# EasyEDA Pro project Air Purifier ESP32C6.eprj

# Schematic Schematic1
Board Name: Board1; Create Date: 2026-03-30; Page Name: P1; Project Name: Air Purifier ESP32C6; Schematic Name: Schematic1; Update Date: 2026-04-22; Company: EasyEDA.com; Page Size: A4; Version: V1.0
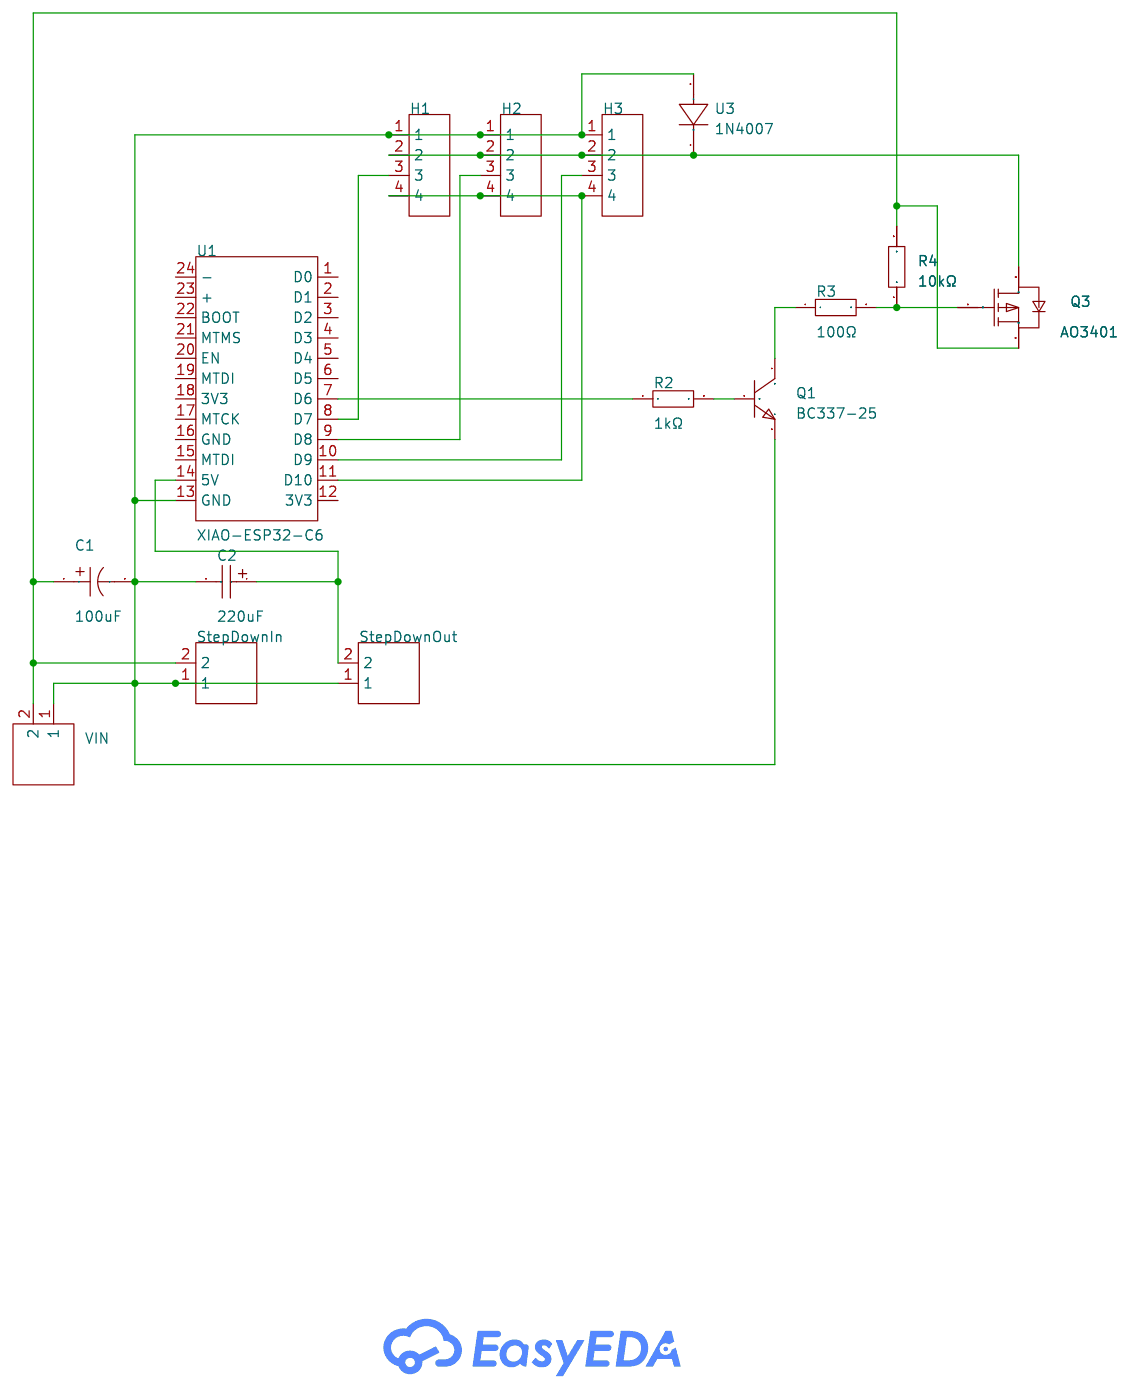
[diagram p0: schematic sheet]

## Parts
C1  100uF  [CAP-SMD_BD6.3-L6.6-W6.6-RD]
C2  220uF  [CASE-D_7343]
H1  -  [HDR-TH_4P-P2.54-V-M]
H2  -  [HDR-TH_4P-P2.54-V-M]
H3  -  [HDR-TH_4P-P2.54-V-M]
Q1  BC337-25  [TO-92-3_L4.9-W3.7-P1.27-L]
Q3  AO3401  [SOT-23-3_L2.9-W1.3-P1.90-LS2.4-BR]
R2  1kΩ  [R1206]
R3  100Ω  [R1206]
R4  10kΩ  [R1206]
StepDownIn  -  [HDR-TH_2P-P2.54-V-M-1]
StepDownOut  -  [HDR-TH_2P-P2.54-V-M-1]
U1  XIAO-ESP32-C6  [LCC-14P_L17.7-W20.8-XIAO-ESP32-C6]
U3  1N4007  [DO-41_BD2.4-L4.7-P8.70-D0.6-RD]
VIN  -  [HDR-TH_2P-P2.54-V-M-1]

## Library data of the parts
C1 = 8101LDMAA07MH0001T: LCSC Part Name: 100uF ±20% 25V; Supplier Part: C2932852; Manufacturer: FH(风华); Supplier Footprint: SMD,D6.3xL7.7mm; JLCPCB Part Class: Extended Part; Datasheet: https://item.szlcsc.com/datasheet/8101LDMAA07MH0001T/3278565.html; Supplier: LCSC; Tolerance: ±20%; Voltage Rating: 25V; Ripple Current: 91mA@120Hz; Diameter: 6.3mm; Height - Seated (Max): 7.7mm; Operating Temperature: -40℃~+105℃
C2 = TAJD227K010RNJ: LCSC Part Name: 220uF ±10% 10V; Supplier Part: C8024; Manufacturer: Kyocera AVX; Supplier Footprint: CASE-D-7343; JLCPCB Part Class: Extended Part; Datasheet: https://atta.szlcsc.com/upload/public/pdf/source/20160107/1457707750344.pdf; Supplier: LCSC; Tolerance: ±10%; Equivalent Series Resistance(ESR): 500mΩ@100kHz; Operating Temperature: -55℃~+125℃
H1-H3 = HDR-M_2.54_1x4P: Supplier Footprint: Through
Q1 = BC337-25_C713610: Supplier Part: C713610; Manufacturer: LGE(鲁光); Supplier Footprint: TO-92-3; JLCPCB Part Class: Extended Part; Datasheet: https://atta.szlcsc.com/upload/public/pdf/source/20200731/C713609_2BF9102A3EBD29C1F5C6CEBDB020064D.pdf; Supplier: LCSC; type: NPN; Current - Collector(Ic): 800mA; Pd - Power Dissipation: 625mW; DC Current Gain: 160@100mA,1V; Transition frequency(fT): 210MHz; Current - Collector Cutoff: 100nA; Vce Saturation(VCE(sat)): 700mV
Q3 = AO3401_C6575062: LCSC Part Name: 1个P沟道 耐压:30V 电流:4.1A; Supplier Part: C6575062; Manufacturer: YONGYUTAI(永裕泰); Supplier Footprint: SOT-23; JLCPCB Part Class: Extended Part; Datasheet: https://item.szlcsc.com/datasheet/AO3401/7529492.html; Supplier: LCSC; Number: 1 P-Channel; Drain to Source Voltage: 30V; Current - Continuous Drain(Id): 4.1A; RDS(on): 65mΩ@4.5V,4A; Pd - Power Dissipation: 1.25W; Gate Threshold Voltage (Vgs(th)): 1.3V; Input Capacitance(Ciss): 870pF@0V; Reverse Transfer Capacitance (Crss@Vds): 10pF; Operating Temperature: -55℃~+150℃; Output Capacitance(Coss): 74pF
R2-R4 = Res_1206: Supplier Footprint: 1206
StepDownIn StepDownOut VIN = HDR-M_2.54_1x2P: Supplier Footprint: Through
U1 = XIAO-ESP32-C6: Supplier Part: C9900124963; Supplier Footprint: LCC-14; JLCPCB Part Class: Extended Part; Supplier: LCSC
U3 = 1N4007_C5261026: LCSC Part Name: 1kV 1A; Supplier Part: C5261026; Manufacturer: CJ(江苏长电/长晶); Supplier Footprint: DO-41; JLCPCB Part Class: Extended Part; Datasheet: https://item.szlcsc.com/datasheet/1N4007/5983537.html; Supplier: LCSC; Voltage - Forward(Vf@If): 1.1V@1A; Voltage - DC Reverse(Vr): 1kV; Current - Rectified: 1A; Reverse Leakage Current (Ir): 5uA@1000V; Non-Repetitive Peak Forward Surge Current: 30A; Operating Junction Temperature Range: -55℃~+150℃

## Nets
GND: C1.2 C2.2 H1.1 H2.1 H3.1 Q1.3(E) StepDownIn.1 StepDownOut.1 U1.13(GND) U3.2(A) VIN.1
VCC: C1.1 Q3.2(S) R4.2 StepDownIn.2 VIN.2
ESPVCC: C2.1 StepDownOut.2 U1.14(5V)
FANVCC: H1.2 H2.2 H3.2 Q3.3(D) U3.1(C)
PWM: H1.4 H2.4 H3.4 U1.11(D10)
TACH1: H1.3 U1.8(D7)
TACH2: H2.3 U1.9(D8)
TACH3: H3.3 U1.10(D9)
$1N1294: R2.1 U1.7(D6)
$1N1298: Q1.2(B) R2.2
$1N2044: Q3.1(G) R3.2 R4.1
$1N2048: Q1.1(C) R3.1

Not connected (* = marked no-connect by the designer): U1 1(D0) 2(D1) 3(D2) 4(D3) 5(D4) 6(D5) 12(3V3) 15(MTDI) 16(GND) 17(MTCK) 18(3V3) 19(MTDI) 20(EN) 21(MTMS) 22(BOOT) 23(+) 24(-)

# Board PCB1
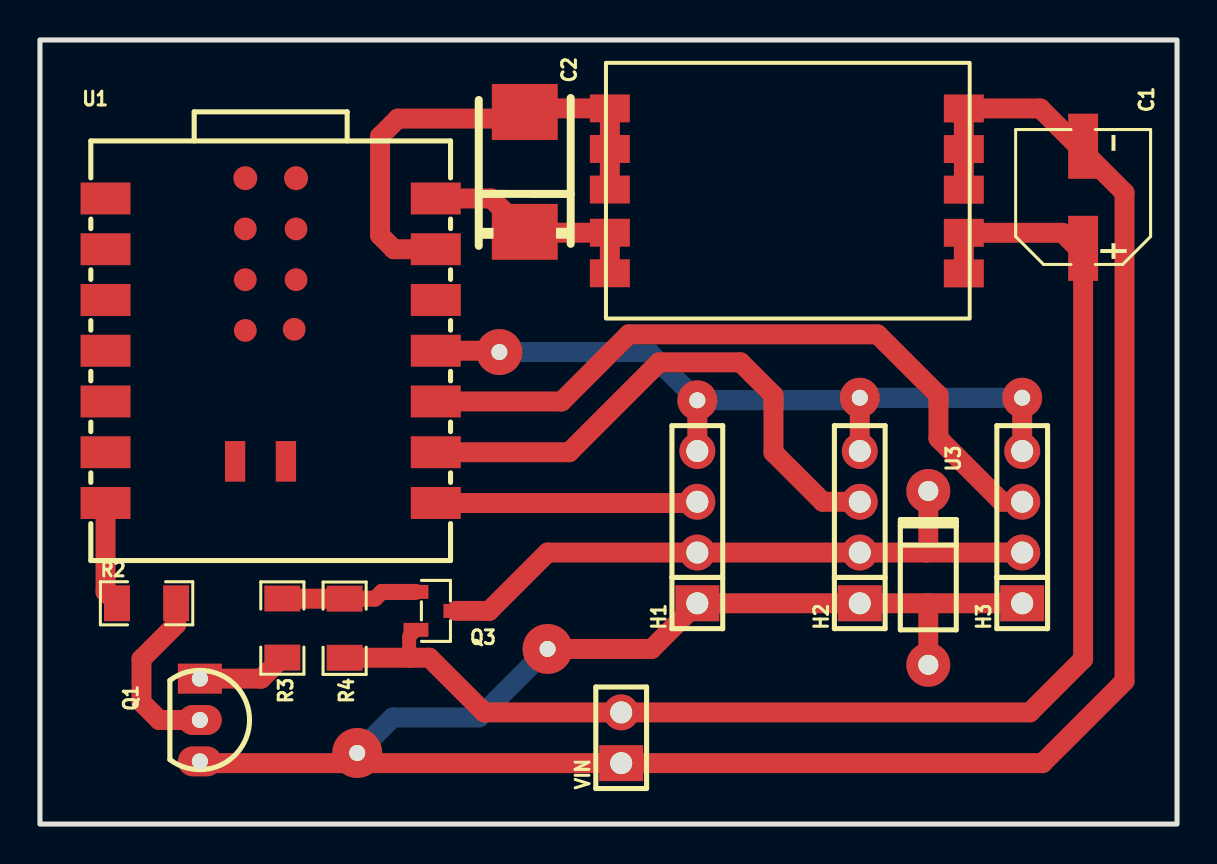
[diagram p1: board, top side]
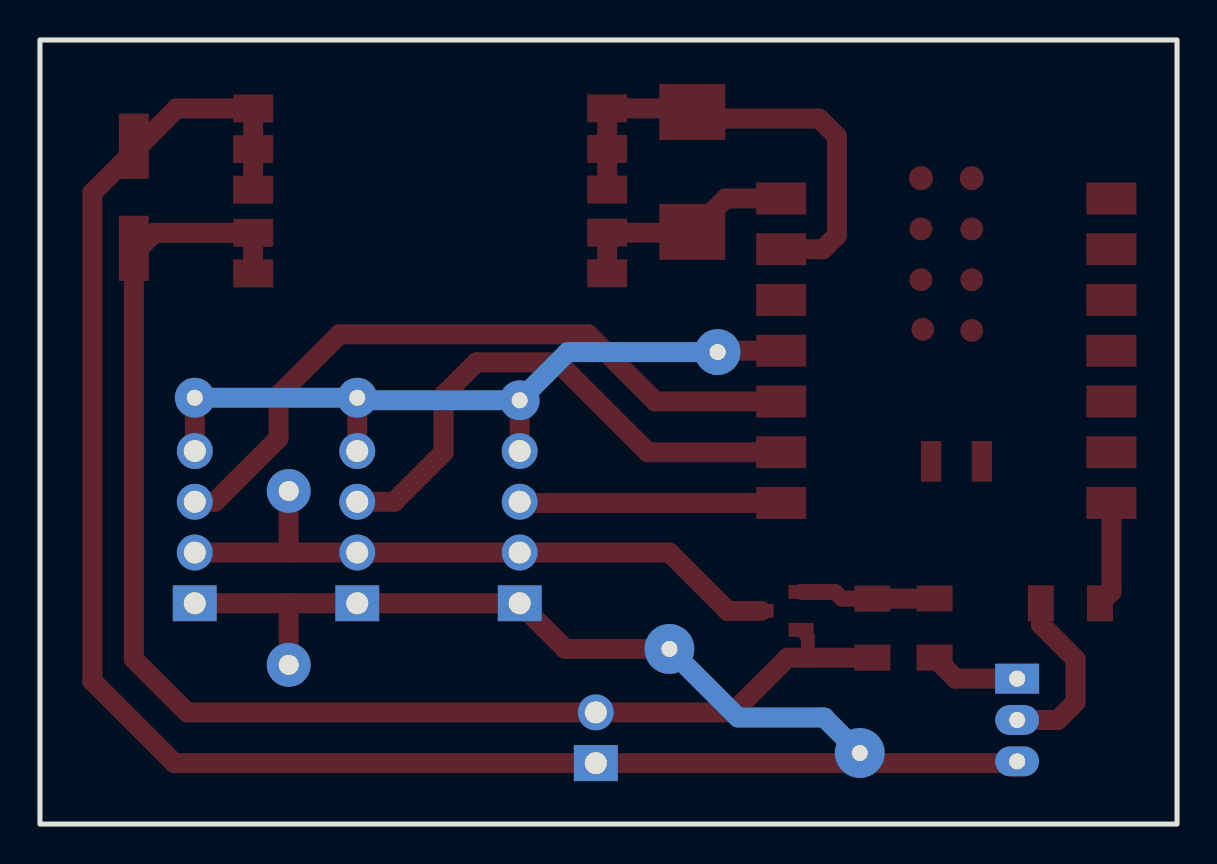
[diagram p2: board, bottom side, seen from below]

Outline 56.9 x 39.24 mm; copper layers: Top Layer, Bottom Layer. Coordinates in mm from the lower left corner of the outline.
Outline path: rectangle 0,39.24 56.9,0
Stack: Top Layer 0.035mm / Dielectric1 1.51mm FR4 er 4.5 / Bottom Layer 0.035mm

## Design rules (mm)
template: Custom Config
spacing copperThickness1oz (default): track to track 0.4, other pairs 0.4 to 2
spacing copperThickness2oz: track to track 0.203, other pairs 0.152 to 0.3
track width copperThickness1oz (default): min 0.5, default 1, max 2.54
track width copperThickness2oz: min 0.203, default 0.254, max 2.54
differential pair differentialPair (default): width min 0.127, default 0.254, max 2.54; gap min 0.152, default 0.152
via viaSize (default): diameter min 0.5, default 0.61, max 10; hole min 0.3, default 0.305, max 6.3

## Placement (name value [footprint] x y rotation side)
C1  100uF  [CAP-SMD_BD6.3-L6.6-W6.6-RD]  52.2 31.37 270 top
C2  220uF  [CASE-D_7343]  24.26 32.64 270 top
H1  -  [HDR-TH_4P-P2.54-V-M]  32.89 14.86 90 top
H2  -  [HDR-TH_4P-P2.54-V-M]  41.02 14.86 90 top
H3  -  [HDR-TH_4P-P2.54-V-M]  49.15 14.86 90 top
NOREF  -  [Pad_e62]  28.52 29.6 90 top
NOREF#2  -  [Pad_e63]  28.52 31.76 90 top
NOREF#3  -  [Pad_e217]  32.89 21.21 0 top
NOREF#4  -  [Pad_e55]  46.23 29.59 90 top
NOREF#5  -  [Pad_e192]  15.87 3.56 0 top
NOREF#6  -  [Pad_e218]  41.02 21.34 0 top
NOREF#7  -  [Pad_e50]  46.23 35.81 90 top
NOREF#8  -  [Pad_e53]  46.23 33.78 90 top
NOREF#9  -  [Pad_e60]  28.52 35.82 90 top
NOREF#10  -  [Pad_e184]  25.4 8.76 0 top
NOREF#11  -  [Pad_e56]  46.23 27.56 90 top
NOREF#12  -  [Pad_e54]  46.23 31.75 90 top
NOREF#13  -  [Pad_e219]  49.15 21.34 0 top
NOREF#14  -  [Pad_e76]  22.99 23.62 0 top
NOREF#15  -  [Pad_e61]  28.52 33.79 90 top
NOREF#16  -  [Pad_e59]  28.52 27.56 90 top
Q1  BC337-25  [TO-92-3_L4.9-W3.7-P1.27-L]  8 5.21 270 top
Q3  AO3401  [SOT-23-3_L2.9-W1.3-P1.90-LS2.4-BR]  19.81 10.67 180 top
R2  1kΩ  [R1206]  5.33 11.05 0 top
R3  100Ω  [R1206]  12.13 9.81 90 top
R4  10kΩ  [R1206]  15.24 9.8 270 top
U1  XIAO-ESP32-C6  [LCC-14P_L17.7-W20.8-XIAO-ESP32-C6]  11.54 24.2 0 top
U3  1N4007  [DO-41_BD2.4-L4.7-P8.70-D0.6-RD]  44.45 12.32 270 top
VIN  -  [HDR-TH_2P-P2.54-V-M-1]  29.08 4.32 90 top

## Footprints (pads in the part's own frame, mm; a bottom-side part is the same pattern mirrored in y, then rotated)
CAP-SMD_BD6.3-L6.6-W6.6-RD
  rect 3.26x1.5 smd: 1(2.555,0) 2(-2.555,0)
CASE-D_7343
  rect 2.799x3.3 smd: 1(3,0) 2(-3,0)
DO-41_BD2.4-L4.7-P8.70-D0.6-RD
  round 2.2 hole 1x0.8: 1(-4.35,0) 2(4.35,0)
HDR-TH_2P-P2.54-V-M-1
  rect 1.8x2.2 hole 1.1x0.8: 1(-1.27,0)
  round 1.8 hole 1.1x0.8: 2(1.27,0)
HDR-TH_4P-P2.54-V-M
  rect 1.8x2.2 hole 1.1x0.9: 1(-3.81,0)
  round 1.8 hole 1.1x0.8: 2(-1.27,0) 3(1.27,0) 4(3.81,0)
LCC-14P_L17.7-W20.8-XIAO-ESP32-C6
  rect 2.5x1.6 smd: 1(-8.262,7.112) 2(-8.262,4.572) 3(-8.262,2.032) 4(-8.262,-0.508) 5(-8.262,-3.048) 6(-8.262,-5.588) 7(-8.262,-8.128) 8(8.262,-8.128) 9(8.262,-5.588) 10(8.262,-3.048) 11(8.262,-0.508) 12(8.262,2.032) 13(8.262,4.572) 14(8.262,7.112)
  round 1.2 smd: 15(-1.27,8.128) 19(1.27,8.128)
  round 1.143 smd: 16(-1.27,5.588) 17(-1.27,3.048) 18(-1.27,0.508) 20(1.27,5.588) 21(1.27,3.048) 22(1.177,0.565)
  rect 1.016x2.032 smd: 23(-1.778,-6.045) 24(0.762,-6.045)
Pad_e50
  rect 1.4x2 smd: (0,0)
Pad_e53
  rect 1.4x2 smd: (0,0)
Pad_e54
  rect 1.4x2 smd: (0,0)
Pad_e55
  rect 1.4x2 smd: (0,0)
Pad_e56
  rect 1.4x2 smd: (0,0)
Pad_e59
  rect 1.4x2 smd: (0,0)
Pad_e60
  rect 1.4x2 smd: (0,0)
Pad_e61
  rect 1.4x2 smd: (0,0)
Pad_e62
  rect 1.4x2 smd: (0,0)
Pad_e63
  rect 1.4x2 smd: (0,0)
Pad_e76
  round 2.3 hole 0.8: 1(0,0)
Pad_e184
  round 2.5 hole 0.8: 1(0,0)
Pad_e192
  round 2.5 hole 0.8: 1(0,0)
Pad_e217
  round 2 hole 0.8: 1(0,0)
Pad_e218
  round 2 hole 0.8: 1(0,0)
Pad_e219
  round 2 hole 0.8: 1(0,0)
R1206
  rect 1.3x1.8 smd: 1(-1.479,0) 2(1.479,0)
SOT-23-3_L2.9-W1.3-P1.90-LS2.4-BR
  rect 1.25x0.7 smd: 1(1,-0.95) 2(1,0.95) 3(-1,0)
TO-92-3_L4.9-W3.7-P1.27-L
  rect 1.5x2.2 hole 0.8: 1(-2.07,0)
  oval 1.5x2.2 hole 0.8: 2(0,0) 3(2.07,0)

## Nets
GND: C1.2 C2.2 H1.1 H2.1 H3.1 NOREF#2. NOREF#5.1 NOREF#7. NOREF#8. NOREF#9. NOREF#10.1 NOREF#12. NOREF#15. Q1.3 U1.13 U3.2 VIN.1
VCC: C1.1 NOREF#4. NOREF#11. Q3.2 R4.2 VIN.2
ESPVCC: C2.1 NOREF. NOREF#16. U1.14
FANVCC: H1.2 H2.2 H3.2 Q3.3 U3.1
PWM: H1.4 H2.4 H3.4 NOREF#3.1 NOREF#6.1 NOREF#13.1 NOREF#14.1 U1.11
TACH1: H1.3 U1.8
TACH2: H2.3 U1.9
TACH3: H3.3 U1.10
$1N1294: R2.1 U1.7
$1N1298: Q1.2 R2.2
$1N2044: Q3.1 R3.2 R4.1
$1N2048: Q1.1 R3.1

Pads without a net: U1 1 2 3 4 5 6 12 15 16 17 18 19 20 21 22 23 24

## Routing (per net, layer and track width the routed paths; a pad name or vN(x,y) marks a point on that pad's centre or on a via; arc(x,y) is an arc through that point)
GND: length 150.2
  Top Layer w1: 28.52,31.76 28.52,35.82 24.44,35.82 C2.2 23.92,35.31 17.91,35.31 17.02,34.42 17.02,29.46 17.71,28.77 U1.13 ; NOREF#10.1 30.61,8.76 H1.1 H2.1 44.43,11.05 ; 44.43,11.05 H3.1 ; 44.43,11.05 44.45,11.03 44.45,7.59 ; 46.23,31.75 46.23,35.81 50.05,35.81 54.27,31.6 54.27,7.15 50.17,3.05 VIN.1 16.38,3.05 NOREF#5.1 15.37,3.05 8.6,3.05 8.51,3.14
  Bottom Layer w1: NOREF#10.1 21.97,5.33 17.65,5.33 NOREF#5.1
VCC: length 69.5
  Top Layer w0.7: Q3.2 18.47,9.38 18.47,8.32
  Top Layer w1: 46.23,27.56 46.23,29.59 51.17,29.59 52.2,28.56 52.2,8.26 49.53,5.59 VIN.2 22.23,5.59 19.49,8.32 R4.2
ESPVCC: length 11.5
  Top Layer w1: 28.52,27.56 28.52,29.6 24.3,29.6 C2.1 22.59,31.31 U1.14
FANVCC: length 32.3
  Top Layer w1: 44.37,13.59 44.45,13.67 44.45,16.29 ; 44.37,13.59 49.15,13.59 ; 44.37,13.59 25.4,13.59 22.48,10.67 Q3.3
PWM: length 38.3
  Top Layer w1: H1.4 NOREF#3.1 ; U1.11 22.92,23.69 NOREF#14.1 ; H3.4 NOREF#13.1 ; H2.4 NOREF#6.1
  Bottom Layer w1: NOREF#14.1 30.48,23.62 NOREF#3.1 40.89,21.21 NOREF#6.1 NOREF#13.1
TACH1: length 13.1
  Top Layer w1: H1.3 32.83,16.07 U1.8
TACH2: length 27.6
  Top Layer w1: H2.3 39.17,16.13 36.7,18.6 36.7,21.46 35.06,23.11 30.98,23.11 26.48,18.61 U1.9
TACH3: length 35.5
  Top Layer w1: H3.3 48.13,16.13 44.96,19.3 44.96,21.46 41.91,24.51 29.46,24.51 26.1,21.15 U1.10
$1N1294: length 5.3
  Top Layer w1: U1.7 3.28,11.62 R2.1
$1N1298: length 9.5
  Top Layer w1: 8.51,5.21 5.97,5.21 5.08,6.1 5.08,8.26 6.81,9.99 R2.2
$1N2044: length 6.8
  Top Layer w0.8: R4.1 16.77,11.28 17.11,11.62 Q3.1
  Top Layer w1: R4.1 12.14,11.28 R3.2
$1N2048: length 4.1
  Top Layer w1: R3.1 11.07,7.28 8.51,7.28
